# EAGLE design NanoShield (EAGLE 7.6.0)
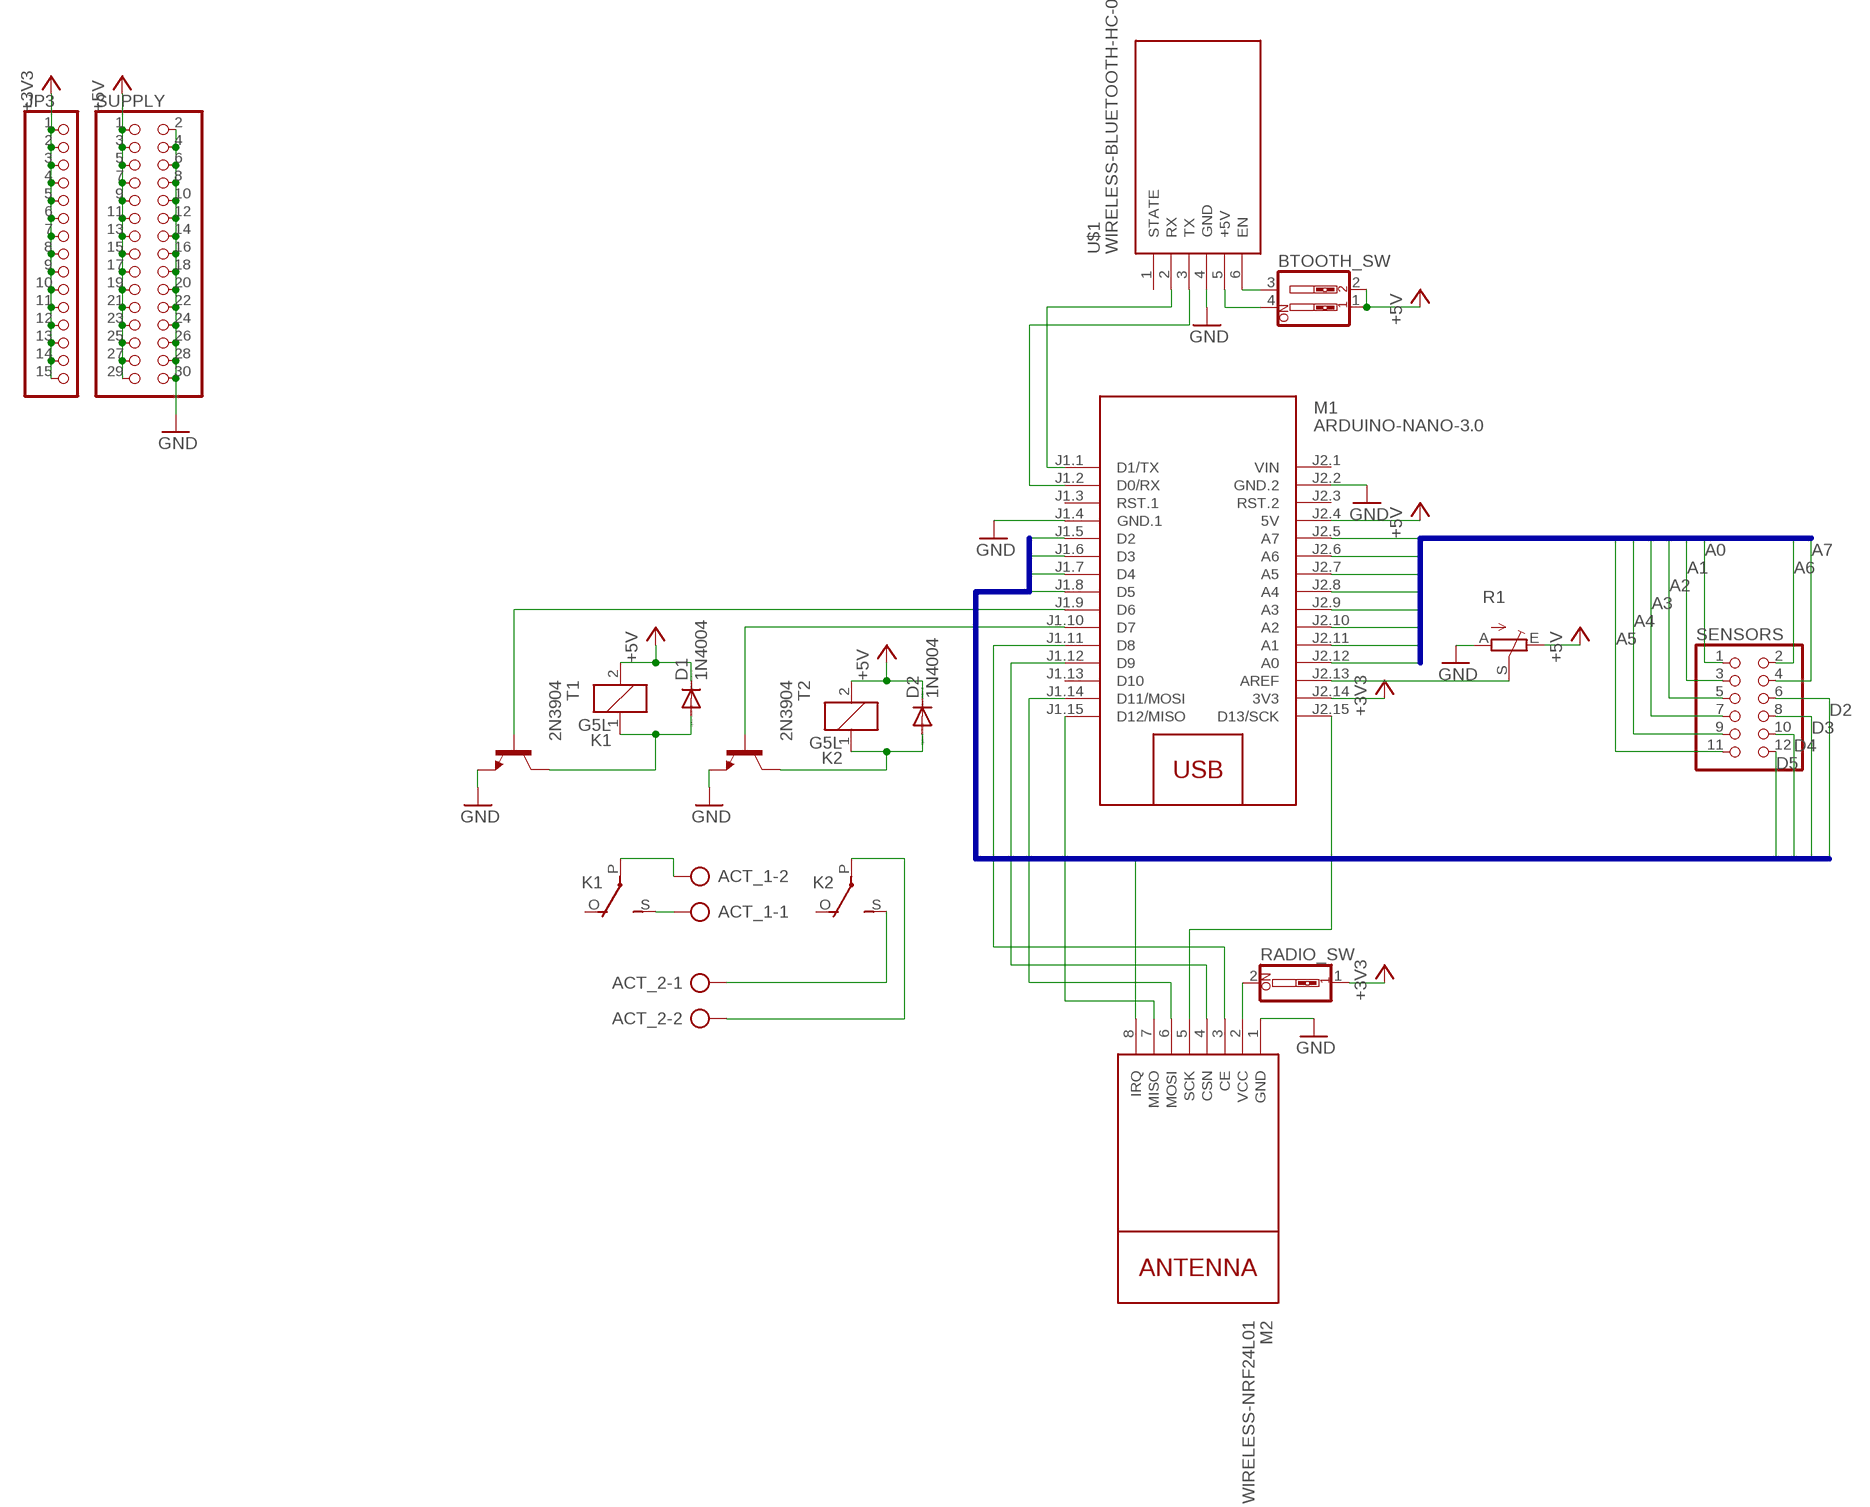
[diagram p0: schematic, sheet 1]

## Parts
ACT_1  AK300/2  [AK300/2]
ACT_2  AK300/2  [AK300/2]
BTOOTH_SW  SW_DIP-2  [EDG-02]
D1  1N4004  [DO41-10]
D2  1N4004  [DO41-10]
JP3  PINHD-1X15  [1X15]
K1  G5L  [G5LE]
K2  G5L  [G5LE]
M1  ARDUINO-NANO-3.0  [ARDUINO-NANO-3.0]
M2  WIRELESS-NRF24L01  [WIRELESS-NRF24L01]
R1  TRIM_EU-LI10  [LI10]
RADIO_SW  SW_DIP-1  [EDG-01]
SENSORS  PINHD-2X6  [2X06]
SUPPLY  PINHD-2X15  [2X15]
T1  2N3904  [TO92]
T2  2N3904  [TO92]
U$1  WIRELESS-BLUETOOTH-HC-05  [WIRELESS-BLUETOOTH-HC-05]

## Nets
+3V3: JP3.1 JP3.2 JP3.3 JP3.4 JP3.5 JP3.6 JP3.7 JP3.8 JP3.9 JP3.10 JP3.11 JP3.12 JP3.13 JP3.14 JP3.15 M1.J2.14(3V3) RADIO_SW.1
+5V: BTOOTH_SW.1 BTOOTH_SW.2 D1.C D2.C K1.2 K2.2 M1.J2.4(5V) R1.E SUPPLY.1 SUPPLY.3 SUPPLY.5 SUPPLY.7 SUPPLY.9 SUPPLY.11 SUPPLY.13 SUPPLY.15 SUPPLY.17 SUPPLY.19 SUPPLY.21 SUPPLY.23 SUPPLY.25 SUPPLY.27 SUPPLY.29
A0: M1.J2.12(A0) SENSORS.1
A1: M1.J2.11(A1) SENSORS.3
A2: M1.J2.10(A2) SENSORS.5
A3: M1.J2.9(A3) SENSORS.7
A4: M1.J2.8(A4) SENSORS.9
A5: M1.J2.7(A5) SENSORS.11
A6: M1.J2.6(A6) SENSORS.2
A7: M1.J2.5(A7) SENSORS.4
D2: M1.J1.5(D2) M2.8(IRQ) SENSORS.6
D3: M1.J1.6(D3) SENSORS.8
D4: M1.J1.7(D4) SENSORS.10
D5: M1.J1.8(D5) SENSORS.12
GND: M1.J1.4(GND.1) M1.J2.2(GND.2) M2.1(GND) R1.A SUPPLY.2 SUPPLY.4 SUPPLY.6 SUPPLY.8 SUPPLY.10 SUPPLY.12 SUPPLY.14 SUPPLY.16 SUPPLY.18 SUPPLY.20 SUPPLY.22 SUPPLY.24 SUPPLY.26 SUPPLY.28 SUPPLY.30 T1.3(E) T2.3(E) U$1.4(GND)
N$1: M1.J2.15(D13/SCK) M2.5(SCK)
N$2: M1.J1.14(D11/MOSI) M2.6(MOSI)
N$3: M1.J1.15(D12/MISO) M2.7(MISO)
N$4: M1.J1.1(D1/TX) U$1.2(RX)
N$5: M1.J1.2(D0/RX) U$1.3(TX)
N$6: M2.2(VCC) RADIO_SW.2
N$7: M1.J1.12(D9) M2.4(CSN)
N$8: BTOOTH_SW.3 U$1.6(EN)
N$9: BTOOTH_SW.4 U$1.5(+5V)
N$10: M1.J2.13(AREF) R1.S
N$11: M1.J1.11(D8) M2.3(CE)
N$12: M1.J1.10(D7) T2.2(B)
N$13: M1.J1.9(D6) T1.2(B)
N$14: D1.A K1.1 T1.1(C)
N$15: ACT_1.1 K1.S(2:S)
N$16: ACT_1.2 K1.P(2:P)
N$17: D2.A K2.1 T2.1(C)
N$18: ACT_2.2 K2.P(2:P)
N$21: ACT_2.1 K2.S(2:S)
Unconnected: K1.O(2:O) K2.O(2:O) M1.J1.3(RST.1) M1.J1.13(D10) M1.J2.3(RST.2) U$1.1(STATE)

## Buses
A[0..7]
D[2..5]

## Power pins joined to a net without a drawn wire
VIN: M1.J2.1(VIN)

## Library data of the parts
ACT_1 ACT_2 = con-ptr500:AK300/2: CONNECTOR; OC_FARNELL: unknown; OC_NEWARK: unknown
BTOOTH_SW = special:SW_DIP-2: DIP SWITCH
D1 D2 = diode:1N4004: DIODE general purpose rectifier, 1 A
JP3 = pinhead:PINHD-1X15: PIN HEADER
K1 K2 = relay:G5L: RELAY 1 x switch, 10 A/120 V AC, 8 A/30 V ADC, Omron; OC_FARNELL: unknown; OC_NEWARK: unknown
M1 = diy-modules:ARDUINO-NANO-3.0: Arduino Nano 3.0 and compatible devices More details available here: https://www.arduino.cc/en/Main/ArduinoBoardNano Click here to find device on ebay.com <http://www.ebay.com/sch/arduino+nano>
M2 = diy-modules:WIRELESS-NRF24L01: 2.4 GHz Wireless Module based on NRF24L01 chip More details available here: http://www.electrodragon.com/w/NRF24L01 Click here to find device on ebay.com <http://www.ebay.com/sch/nrf24l01+arduino>
R1 = pot:TRIM_EU-: POTENTIOMETER
RADIO_SW = special:SW_DIP-1: DIP SWITCH
SENSORS = pinhead:PINHD-2X6: PIN HEADER
SUPPLY = pinhead:PINHD-2X15: PIN HEADER
T1 T2 = transistor:2N3904: NPN TRANSISTOR
U$1 = diy-modules:WIRELESS-BLUETOOTH-HC-05: Bluetooth Transceiver Module based on HC-05 board Tutorial is available here: https://arduino-info.wikispaces.com/BlueTooth-HC05-HC06-Modules-How-To Click here to find device on ebay.com <http://www.ebay.com/sch/hc-05+module+rs232>

## Board
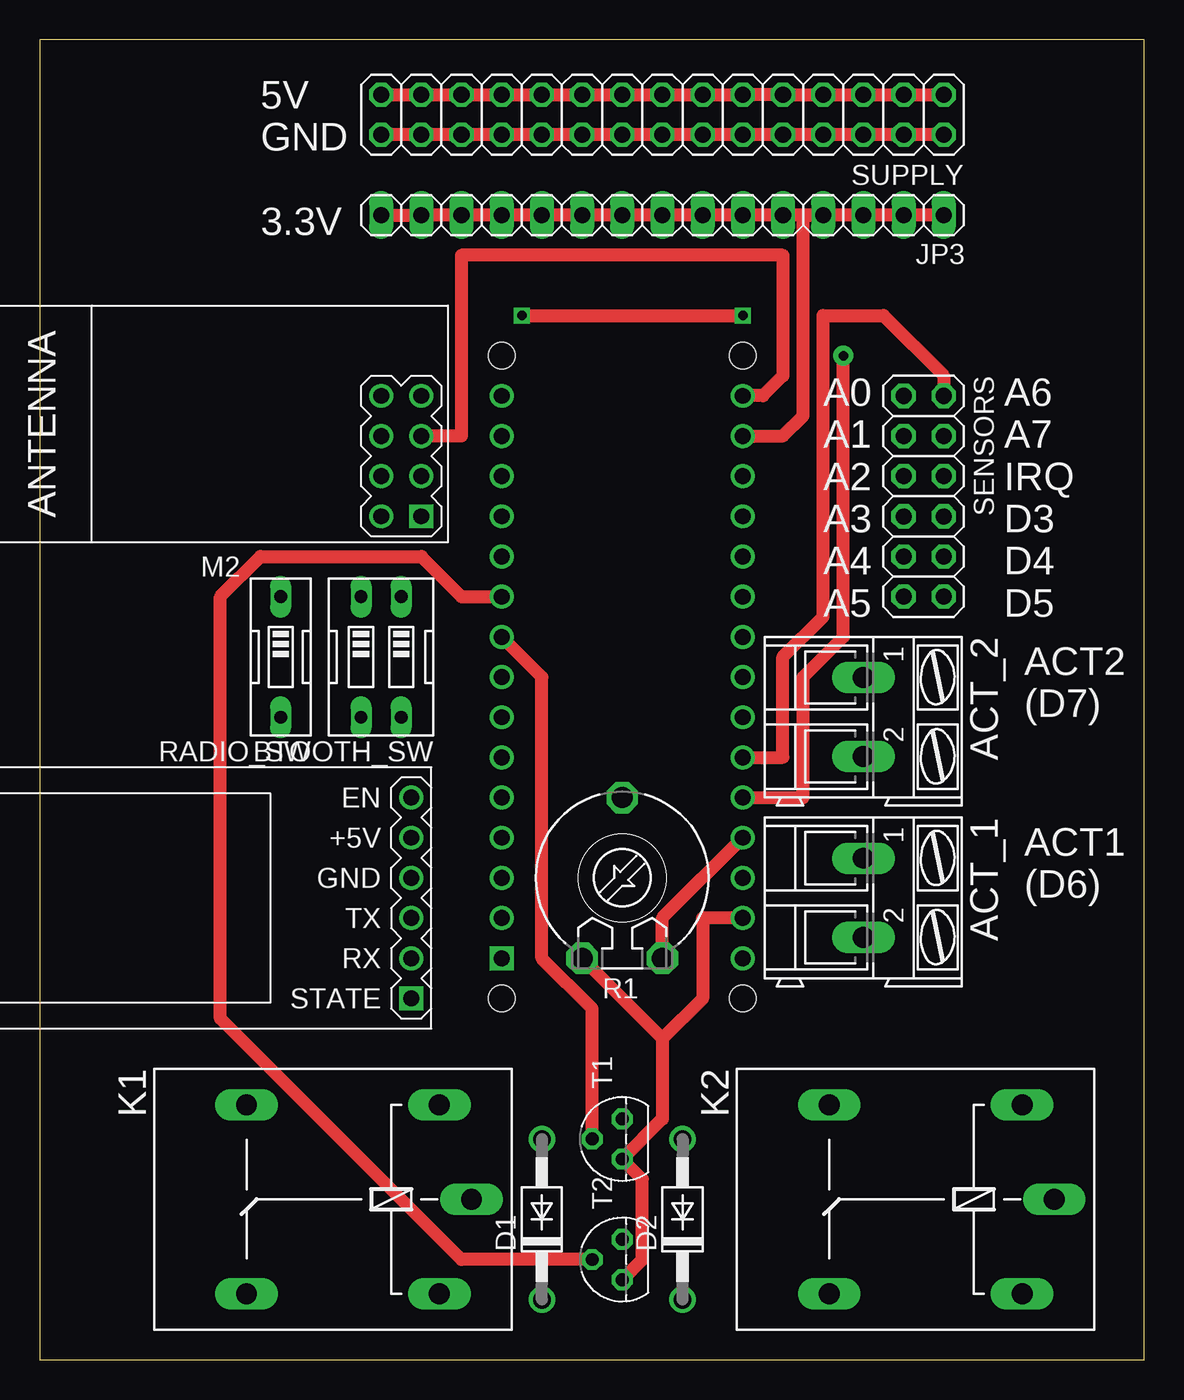
[diagram p1: board, top side]
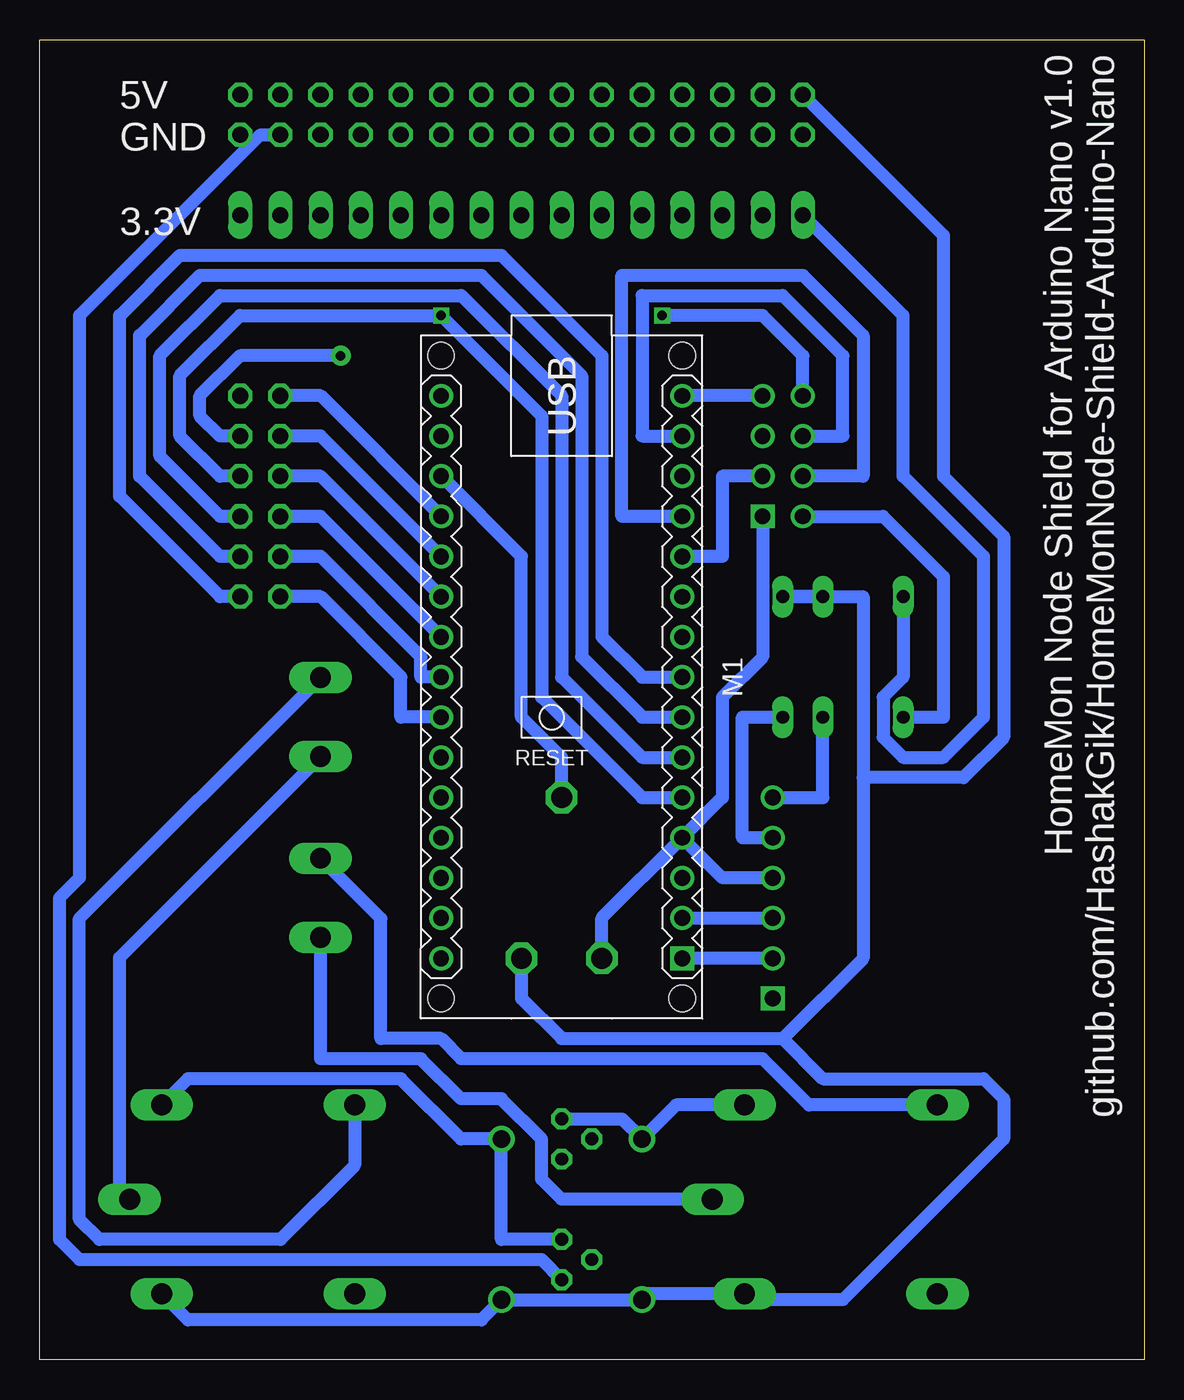
[diagram p2: board, bottom side, seen from below]

Size 69.83 x 83.49 mm. Coordinates in mm from the lower left corner, seen from the top.
Outline: 0,0 69.83,0 69.83,83.49 0,83.49 0,0
Copper layers (1*16): Top 0.035mm / dielectric 1.5mm / Bottom 0.035mm
Design rules "default": minimum track width 10mil, minimum drill 24mil, track to track 8mil, track to pad 8mil, pad to pad 8mil, via to via 8mil, smd to smd 8mil, copper to edge 40mil, drill to drill 8mil, minimum pad ring 10mil, minimum via ring 8mil, stop-mask expansion 4mil, vias tented up to drill 0mil, thermal gap 10mil

### Footprints (pad centres in the part's own frame; a part is rotated, then mirrored left to right if it is on the bottom)
AK300/2 = drill 1.321 long: 1 -2.515,0; 2 2.489,0
EDG-02 = drill 0.813 long: 1 -1.27,-3.81; 2 1.27,-3.81; 3 1.27,3.81; 4 -1.27,3.81
DO41-10 = drill 1.118: A 5.08,0; C -5.08,0
1X15 = drill 1.016 long: 1 -17.78,0; 2 -15.24,0; 3 -12.7,0; 4 -10.16,0; 5 -7.62,0; 6 -5.08,0; 7 -2.54,0; 8 0,0; 9 2.54,0; 10 5.08,0; 11 7.62,0; 12 10.16,0; 13 12.7,0; 14 15.24,0; 15 17.78,0
G5LE = drill 1.321 long: 1 -7.493,-5.969; 2 -7.493,5.969; O 4.699,5.969; P -9.525,0; S 4.699,-5.969
ARDUINO-NANO-3.0 = drill 1 square: J1.1 17.78,7.62 | drill 1: J1.2 15.24,7.62; J1.3 12.7,7.62; J1.4 10.16,7.62; J1.5 7.62,7.62; J1.6 5.08,7.62; J1.7 2.54,7.62; J1.8 0,7.62; J1.9 -2.54,7.62; J1.10 -5.08,7.62; J1.11 -7.62,7.62; J1.12 -10.16,7.62; J1.13 -12.7,7.62; J1.14 -15.24,7.62; J1.15 -17.78,7.62; J2.1 17.78,-7.62; J2.2 15.24,-7.62; J2.3 12.7,-7.62; J2.4 10.16,-7.62; J2.5 7.62,-7.62; J2.6 5.08,-7.62; J2.7 2.54,-7.62; J2.8 0,-7.62; J2.9 -2.54,-7.62; J2.10 -5.08,-7.62; J2.11 -7.62,-7.62; J2.12 -10.16,-7.62; J2.13 -12.7,-7.62; J2.14 -15.24,-7.62; J2.15 -17.78,-7.62 | hole 1.651: -20.32,7.62; -20.32,-7.62; 20.32,-7.62; 20.32,7.62
WIRELESS-NRF24L01 = drill 1 square: 1 -12.7,6.35 | drill 1: 2 -10.16,6.35; 3 -12.7,3.81; 4 -10.16,3.81; 5 -12.7,1.27; 6 -10.16,1.27; 7 -12.7,-1.27; 8 -10.16,-1.27
LI10 = drill 1.321 octagon: A -2.54,-5.08; E 2.54,-5.08; S 0,5.08
EDG-01 = drill 0.813 long: 1 0,-3.81; 2 0,3.81
2X06 = drill 1.016 octagon: 1 -6.35,-1.27; 2 -6.35,1.27; 3 -3.81,-1.27; 4 -3.81,1.27; 5 -1.27,-1.27; 6 -1.27,1.27; 7 1.27,-1.27; 8 1.27,1.27; 9 3.81,-1.27; 10 3.81,1.27; 11 6.35,-1.27; 12 6.35,1.27
2X15 = drill 1.016 octagon: 1 -17.78,-1.27; 2 -17.78,1.27; 3 -15.24,-1.27; 4 -15.24,1.27; 5 -12.7,-1.27; 6 -12.7,1.27; 7 -10.16,-1.27; 8 -10.16,1.27; 9 -7.62,-1.27; 10 -7.62,1.27; 11 -5.08,-1.27; 12 -5.08,1.27; 13 -2.54,-1.27; 14 -2.54,1.27; 15 0,-1.27; 16 0,1.27; 17 2.54,-1.27; 18 2.54,1.27; 19 5.08,-1.27; 20 5.08,1.27; 21 7.62,-1.27; 22 7.62,1.27; 23 10.16,-1.27; 24 10.16,1.27; 25 12.7,-1.27; 26 12.7,1.27; 27 15.24,-1.27; 28 15.24,1.27; 29 17.78,-1.27; 30 17.78,1.27
TO92 = drill 0.813 octagon: 1 1.27,0; 2 0,1.905; 3 -1.27,0
WIRELESS-BLUETOOTH-HC-05 = drill 1 square: 1 -6.35,-17.145 | drill 1: 2 -3.81,-17.145; 3 -1.27,-17.145; 4 1.27,-17.145; 5 3.81,-17.145; 6 6.35,-17.145

### Placement (x,y rotation side)
ACT_1  52.07,29.21 270 top
ACT_2  52.07,40.64 270 top
BTOOTH_SW  21.59,44.45 180 top
D1  31.75,8.89 90 top
D2  40.64,8.89 90 top
JP3  39.37,72.39 180 top
K1  17.78,10.16 180 top
K2  54.61,10.16 180 top
M1  36.83,43.18 270 bottom
M2  11.43,59.69 180 top
R1  36.83,30.48 0 top
RADIO_SW  15.24,44.45 180 top
SENSORS  55.88,54.61 270 top
SUPPLY  39.37,78.74 180 top
T1  36.83,13.97 90 top
T2  36.83,6.35 90 top
U$1  6.35,29.21 90 top

### Tracks (layer width: path | path; a pad name or v marks a point on that pad's centre or on a via)
+3V3
  Top 0.813: JP3.15 JP3.14 JP3.13 JP3.12 JP3.11 JP3.10 JP3.9 JP3.8 JP3.7 JP3.6 JP3.5 JP3.4 | JP3.4 JP3.3 JP3.2 JP3.1 | M1.J2.14 46.99,58.42 48.26,59.69 48.26,72.39 JP3.4
  Bottom 0.813: RADIO_SW.1 15.24,43.18 16.51,41.91 16.51,39.37 15.24,38.1 12.7,38.1 10.16,40.64 10.16,50.8 15.24,55.88 15.24,66.04 JP3.15
+5V
  Top 0.813: SUPPLY.29 SUPPLY.27 SUPPLY.25 SUPPLY.23 SUPPLY.21 SUPPLY.19 SUPPLY.17 SUPPLY.15 SUPPLY.13 SUPPLY.11 SUPPLY.9 SUPPLY.7 SUPPLY.5 SUPPLY.3 SUPPLY.1 | R1.E 39.37,27.94 M1.J2.4
  Bottom 0.813: BTOOTH_SW.2 BTOOTH_SW.1 17.78,48.26 17.78,36.83 | K2.2 60.45,2.54 41.91,2.54 D2.C D1.C 31.37,4.19 K1.2 24.89,3.81 19.05,3.81 8.89,13.97 8.89,16.51 10.16,17.78 20.32,17.78 22.86,20.32 | R1.E 39.37,22.86 36.83,20.32 22.86,20.32 | 17.78,36.83 17.78,25.4 22.86,20.32 | 17.78,36.83 11.43,36.83 8.89,39.37 8.89,52.07 12.7,55.88 12.7,71.12 SUPPLY.29
A0
  Bottom 0.813: M1.J2.12 52.07,60.96 SENSORS.1
A1
  Bottom 0.813: M1.J2.11 52.07,58.42 SENSORS.3
A2
  Bottom 0.813: M1.J2.10 52.07,55.88 SENSORS.5
A3
  Bottom 0.813: M1.J2.9 52.07,53.34 SENSORS.7
A4
  Bottom 0.813: M1.J2.8 45.72,43.18 45.72,44.45 52.07,50.8 SENSORS.9
A5
  Bottom 0.813: M1.J2.7 46.99,40.64 46.99,43.18 52.07,48.26 SENSORS.11
A6
  Top 0.813: M1.J2.6 46.99,38.1 46.99,44.45 49.53,46.99 49.53,66.04 53.34,66.04 57.15,62.23 SENSORS.2
A7  (via drill 0.6 pad 1.27)
  Top 0.813: M1.J2.5 48.26,35.56 48.26,43.18 50.8,45.72 v50.8,63.5
  Bottom 0.813: SENSORS.4 58.42,58.42 59.69,59.69 59.69,60.96 57.15,63.5 v50.8,63.5
D2  (via drill 0.6)
  Top 0.813: v30.48,66.04 v44.45,66.04
  Bottom 0.813: M1.J1.5 31.75,35.56 38.1,41.91 38.1,59.69 v44.45,66.04 57.15,66.04 60.96,62.23 60.96,58.42 58.42,55.88 SENSORS.6 | v30.48,66.04 24.13,66.04 21.59,63.5 M2.8
D3
  Bottom 0.813: M1.J1.6 31.75,38.1 36.83,43.18 36.83,60.96 43.18,67.31 58.42,67.31 62.23,63.5 62.23,57.15 58.42,53.34 SENSORS.8
D4
  Bottom 0.813: M1.J1.7 31.75,40.64 35.56,44.45 35.56,62.23 41.91,68.58 59.69,68.58 63.5,64.77 63.5,55.88 58.42,50.8 SENSORS.10
D5
  Bottom 0.813: M1.J1.8 31.75,43.18 34.29,45.72 34.29,63.5 40.64,69.85 60.96,69.85 64.77,66.04 64.77,54.61 58.42,48.26 SENSORS.12
GND
  Top 0.813: SUPPLY.2 SUPPLY.4 SUPPLY.6 SUPPLY.8 SUPPLY.10 SUPPLY.12 SUPPLY.14 SUPPLY.16 SUPPLY.18 SUPPLY.20 SUPPLY.22 SUPPLY.24 SUPPLY.26 SUPPLY.28 SUPPLY.30 | R1.A 39.37,20.32 | 39.37,20.32 39.37,15.24 T1.3 38.1,11.43 38.1,6.35 T2.3 | M1.J2.2 41.91,27.94 41.91,22.86 39.37,20.32
  Bottom 0.813: U$1.4 26.67,30.48 M1.J1.4 | R1.A 34.29,27.94 M1.J1.4 | M2.1 24.13,44.45 26.67,41.91 26.67,35.56 M1.J1.4 | T2.3 38.1,6.35 67.31,6.35 68.58,7.62 68.58,29.21 67.31,30.48 67.31,66.04 55.88,77.47 SUPPLY.4
N$1
  Top 0.813: M2.5 26.67,58.42 26.67,69.85 46.99,69.85 46.99,62.23 45.72,60.96 M1.J2.15
N$2
  Bottom 0.813: M2.6 19.05,58.42 19.05,63.5 22.86,67.31 31.75,67.31 31.75,58.42 M1.J1.14
N$3
  Bottom 0.813: M2.7 M1.J1.15
N$4
  Bottom 0.813: U$1.2 M1.J1.1
N$5
  Bottom 0.813: M1.J1.2 U$1.3
N$6
  Bottom 0.813: RADIO_SW.2 12.7,40.64 12.7,49.53 16.51,53.34 M2.2
N$7
  Bottom 0.813: M1.J1.12 33.02,53.34 33.02,68.58 21.59,68.58 17.78,64.77 17.78,55.88 M2.4
N$8
  Bottom 0.813: U$1.6 20.32,35.56 BTOOTH_SW.3
N$9
  Bottom 0.813: U$1.5 25.4,33.02 25.4,40.64 BTOOTH_SW.4
N$10
  Bottom 0.813: R1.S 36.83,38.1 39.37,40.64 39.37,50.8 M1.J2.13
N$11
  Bottom 0.813: M2.3 26.67,55.88 26.67,50.8 M1.J1.11
N$12
  Top 0.813: T2.2 26.67,6.35 11.43,21.59 11.43,48.26 13.97,50.8 24.13,50.8 26.67,48.26 M1.J1.10
N$13
  Top 0.813: T1.2 34.92,22.23 31.75,25.4 31.75,43.18 M1.J1.9
N$14
  Bottom 0.813: T1.1 33.02,15.24 D1.A 29.59,16.13 K1.1
N$15
  Bottom 0.813: K1.S 21.21,16.13 24.13,19.05 43.18,19.05 44.45,20.32 48.26,20.32 48.26,27.91 ACT_1.1
N$16
  Bottom 0.813: K1.P 36.83,10.16 38.1,11.43 38.1,13.97 40.64,16.51 43.18,16.51 45.72,19.05 52.07,19.05 ACT_1.2
N$17
  Bottom 0.813: T2.1 40.64,7.62 D2.A 43.18,13.97 46.99,17.78 60.45,17.78 K2.1
N$18
  Bottom 0.813: K2.P 64.77,10.16 64.77,25.45 ACT_2.2
N$21
  Bottom 0.813: K2.S 49.91,12.32 54.61,7.62 66.04,7.62 67.31,8.89 67.31,27.91 ACT_2.1

### Text on the board
tPlace: 5V / GND / / 3.3V | A0 / A1 / A2 / A3 / A4 / A5 | A6 / A7 / IRQ / D3 / D4 / D5 | ACT2 / (D7) | ACT1 / (D6)
bPlace: HomeMon Node Shield for Arduino Nano v1.0 / github.com/HashakGik/HomeMonNode-Shield-Arduino-Nano | 5V / GND / / 3.3V